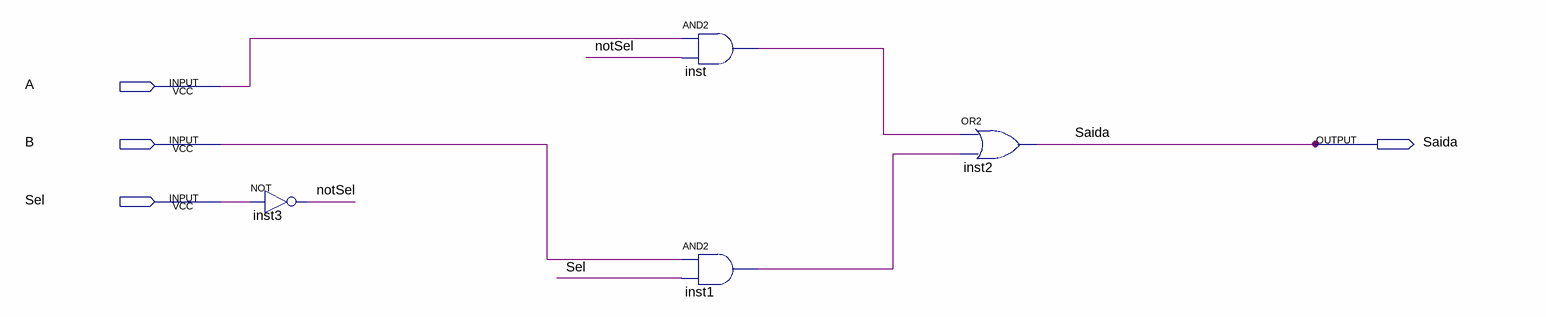
[diagram p0: schematic sheet]
// Quartus schematic Mux2p1.bdf as structural Verilog: 4 symbols, 4 pins
module Mux2p1 (
  input  A,
  input  B,
  input  Sel,
  output Saida
);

  wire inst1_out, inst_out, notSel;

  not inst3 (notSel, Sel);
  and inst (inst_out, A, notSel);
  and inst1 (inst1_out, B, Sel);
  or inst2 (Saida, inst_out, inst1_out);
endmodule
